# Altium schematic sheet Power.SchDoc
size 209 x 148 mm; Author: vseasky; Address1: https://docs.liuwei.vin; Revision: V0.2; SheetNumber: 2; SheetTotal: 4
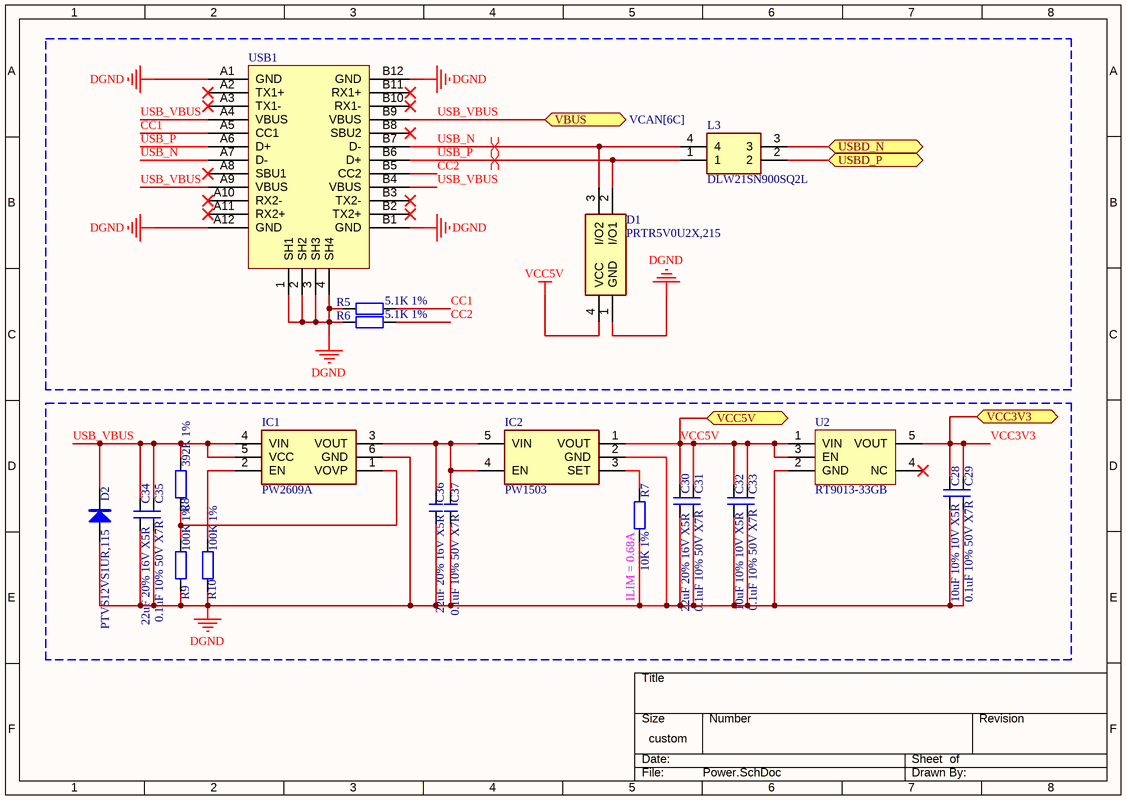
[diagram p0: Power.SchDoc]

## Parts
C28  10uF 10% 10V X5R  [C 0603_L]
C29  0.1uF 10% 50V X7R  [C 0603_L]
C30  22uF 20% 16V X5R  [C 0603_L]
C31  0.1uF 10% 50V X7R  [C 0603_L]
C32  10uF 10% 10V X5R  [C 0603_L]
C33  0.1uF 10% 50V X7R  [C 0603_L]
C34  22uF 20% 16V X5R  [C 0603_L]
C35  0.1uF 10% 50V X7R  [C 0603_L]
C36  22uF 20% 16V X5R  [C 0603_L]
C37  0.1uF 10% 50V X7R  [C 0603_L]
D1  PRTR5V0U2X,215  [SOT-143]
D2  PTVS12VS1UR,115  [SOD-123]
IC1  PW2609A  [SOT-23-6]
IC2  PW1503  [SOT23-5]
L3  DLW21SN900SQ2L  [DLW21SN121HQ2L]
R5  5.1K 1%  [R 0603_L]
R6  5.1K 1%  [R 0603_L]
R7  10K 1%  [R 0603_L]
R8  392K 1%  [R 0603_L]
R9  100K 1%  [R 0603_L]
R10  100K 1%  [R 0603_L]
U2  RT9013-33GB  [SOT23-5M]
USB1  (no value)  [Type-C-TOP]

## Ports
USBD_N (bidir, see VCAN[6C]), USBD_P (bidir, see VCAN[6D]), VBUS (bidir, see VCAN[6C]), VCC3V3 (bidir, see VCAN[6C]), VCC5V (bidir, see VCAN[6C], FDCAN-ISO[8F])

## Nets
DGND: C28.2 C29.2 C30.1 C31.2 C32.2 C33.2 C34.1 C35.1 C36.1 C37.1 D1.1(GND) D2.1(A) IC1.6(GND) IC2.2(GND) R5.1 R6.1 R7.1 R9.2 R10.2 U2.2(GND) USB1.1(SH1) USB1.2(SH2) USB1.3(SH3) USB1.4(SH4) USB1.A1(GND) USB1.A12(GND) USB1.B1(GND) USB1.B12(GND)
VCC5V: C30.2 C31.1 C32.1 C33.1 D1.4(VCC) IC2.1(VOUT) U2.1(VIN) U2.3(EN) ; port VCC5V
CC1: R5.2 USB1.A5(CC1)
CC2: R6.2 USB1.B5(CC2)
USB_N: D1.3(I/O2) L3.4 USB1.A7(D-) USB1.B7(D-)
USB_P: D1.2(I/O1) L3.1 USB1.A6(D+) USB1.B6(D+)
USB_VBUS: C34.2 C35.2 D2.2(K) IC1.4(VIN) IC1.5(VCC) R8.1 USB1.A4(VBUS) USB1.A9(VBUS) USB1.B4(VBUS) USB1.B9(VBUS) ; port VBUS
USBD_N: L3.3 ; port USBD_N
USBD_P: L3.2 ; port USBD_P
VCC3V3: C28.1 C29.1 U2.5(VOUT) ; port VCC3V3
NetC36_2: C36.2 C37.2 IC1.3(VOUT) IC2.4(EN) IC2.5(VIN)
NetIC1_1: IC1.1(VOVP) R8.2 R9.1
NetIC1_2: IC1.2(EN) R10.1
NetIC2_3: IC2.3(SET) R7.2

Not connected (* = marked no-connect by the designer): U2 4(NC)*; USB1 A2(TX1+)* A3(TX1-)* A8(SBU1)* A10(RX2-)* A11(RX2+)* B2(TX2+)* B3(TX2-)* B8(SBU2)* B10(RX1-)* B11(RX1+)*

## Layout directives
differential pair: USB_N, USB_P

## Notes on the sheet
- (near R7) ILIM = 0.68A

## Library data of the parts
C28-C37 = C: 贴片电容
D1 = PRTR5V0U2X,215: Diode; Manufacturer_Name: Nexperia; Datasheet Link: https://assets.nexperia.com/documents/data-sheet/PRTR5V0U2X.pdf; Height: 1.1mm; Manufacturer_Part_Number: PRTR5V0U2X,215; Mouser Part Number: 771-PRTR5V0U2X-T/R; Mouser Price/Stock: https://www.mouser.co.uk/ProductDetail/Nexperia/PRTR5V0U2X215?qs=LOCUfHb8d9sDkgY4cRj8Lw%3D%3D; Arrow Part Number: PRTR5V0U2X,215; Arrow Price/Stock: https://www.arrow.com/en/products/prtr5v0u2x215/nexperia?utm_currency=USD&region=nac
D2 = 1N4007: 整流二极管
IC1 = PW2609A: Integrated Circuit; Manufacturer_Name: Aerosemi; Manufacturer_Part_Number: MT9700; Datasheet Link: https://datasheet.lcsc.com/szlcsc/1809291208_XI-AN-Aerosemi-Tech-MT9700_C89855.pdf; Height: 1.35mm
IC2 = MT9700: Integrated Circuit; Manufacturer_Name: Aerosemi; Datasheet Link: https://datasheet.lcsc.com/szlcsc/1809291208_XI-AN-Aerosemi-Tech-MT9700_C89855.pdf; Height: 1.35mm; Manufacturer_Part_Number: MT9700
L3 = DLW21SN900SQ2L: Inductor; Manufacturer_Name: Murata Electronics; Datasheet Link: https://datasheet.datasheetarchive.com/originals/distributors/Datasheets_SAMA/ece8820704b5ec0ab68e5b2fda1b5649.pdf; Height: 1.4mm; Manufacturer_Part_Number: DLW21SN900SQ2L; Mouser Part Number: 81-DLW21SN900SQ2L; Mouser Price/Stock: https://www.mouser.co.uk/ProductDetail/Murata-Electronics/DLW21SN900SQ2L?qs=yQ3nQrcaeVsNzdZbwxOhwQ%3D%3D; Arrow Part Number: DLW21SN900SQ2L; Arrow Price/Stock: https://www.arrow.com/en/products/dlw21sn900sq2l/murata-manufacturing?region=europe
R5-R10 = R: 贴片电阻
USB1 = USB_Type-C